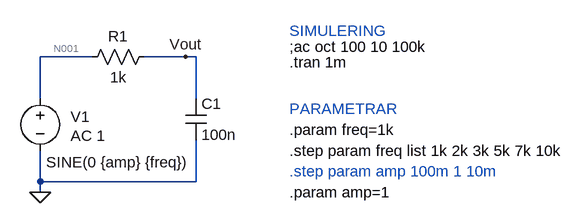
[diagram p0: schematic lab4_1.asc]
lab4_1.asc, the LTspice schematic file:
Version 4
SHEET 1 880 680
WIRE 48 80 -32 80
WIRE 192 80 128 80
WIRE 208 80 192 80
WIRE -32 144 -32 80
WIRE 208 144 208 80
WIRE -32 272 -32 224
WIRE 208 272 208 208
WIRE 208 272 -32 272
WIRE -32 288 -32 272
FLAG -32 288 0
FLAG 192 80 Vout
SYMBOL voltage -32 128 R0
WINDOW 0 47 44 Left 2
WINDOW 3 9 114 Left 2
WINDOW 123 47 73 Left 2
WINDOW 39 0 0 Left 2
SYMATTR InstName V1
SYMATTR Value SINE(0 {amp} {freq})
SYMATTR Value2 AC 1
SYMBOL res 144 64 R90
WINDOW 0 0 56 VBottom 2
WINDOW 3 32 56 VTop 2
SYMATTR InstName R1
SYMATTR Value 1k
SYMBOL cap 192 144 R0
SYMATTR InstName C1
SYMATTR Value 100n
TEXT 352 256 Left 2 ;.step param amp 100m 1 10m
TEXT 352 288 Left 2 !.param amp=1
TEXT 352 64 Left 2 !;ac oct 100 10 100k
TEXT 352 224 Left 2 !.step param freq list 1k 2k 3k 5k 7k 10k
TEXT 352 192 Left 2 !.param freq=1k
TEXT 352 88 Left 2 !.tran 1m
TEXT 352 40 Left 2 ;SIMULERING
TEXT 352 160 Left 2 ;PARAMETRAR

The netlist it stands for:
* lab4_1.asc
V1 N001 0 SINE(0 {amp} {freq}) AC 1
R1 Vout N001 1k
C1 Vout 0 100n
* .step param amp 100m 1 10m
.param amp=1
;ac oct 100 10 100k
.step param freq list 1k 2k 3k 5k 7k 10k
.param freq=1k
.tran 1m
* SIMULERING
* PARAMETRAR
.backanno
.end

* Results of the author's LTspice run, read from the files saved beside the schematic
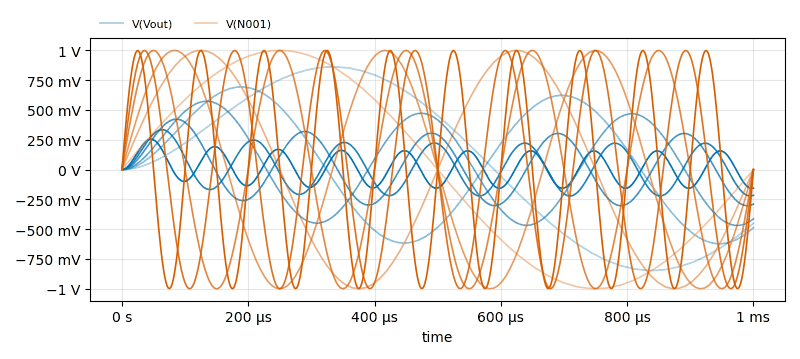
[diagram p1: Transient Analysis of lab4_1.asc, plotted from the saved traces]
* Transient Analysis, 11 runs:
*   V(Vout) [run 1]: min -846 mV, max 862.2 mV, average 45.14 mV, rms 607 mV, last -450.5 mV
*   V(Vout) [run 2]: 0 V at time=0 s, 0 V at time=0 s, min 0 V, max 0 V
*   V(Vout) [run 3]: min -622.6 mV, max 693.5 mV, average 48.74 mV, rms 453.5 mV, last -487.2 mV
*   V(Vout) [run 4]: 0 V at time=0 s, 0 V at time=0 s, min 0 V, max 0 V
*   V(Vout) [run 5]: min -468.6 mV, max 573.2 mV, average 41.4 mV, rms 344 mV, last -414 mV
*   V(Vout) [run 6]: 0 V at time=0 s, 0 V at time=0 s, min 0 V, max 0 V
*   V(Vout) [run 7]: min -303.1 mV, max 422.9 mV, average 28.9 mV, rms 223.9 mV, last -289 mV
*   V(Vout) [run 8]: 0 V at time=0 s, 0 V at time=0 s, min 0 V, max 0 V
*   V(N001) [run 1]: min -999.4 mV, max 999.6 mV, average 169.4 µV, rms 707.1 mV, last 0 V
*   V(N001) [run 2]: 0 V at time=0 s, 0 V at time=0 s, min 0 V, max 0 V
*   V(N001) [run 3]: min -1 V, max 999.1 mV, average 80.21 µV, rms 707 mV, last 0 V
*   V(N001) [run 4]: 0 V at time=0 s, 0 V at time=0 s, min 0 V, max 0 V
*   V(N001) [run 5]: min -999.6 mV, max 999.9 mV, average 31.11 µV, rms 707 mV, last 0 V
*   V(N001) [run 6]: 0 V at time=0 s, 0 V at time=0 s, min 0 V, max 0 V
*   V(N001) [run 7]: min -999.8 mV, max 999.8 mV, average 6.009 µV, rms 706.9 mV, last 0 V
*   V(N001) [run 8]: 0 V at time=0 s, 0 V at time=0 s, min 0 V, max 0 V